# Altium schematic sheet AltiumSTM32_Schematic.SchDoc
size A3; SheetNumber: 1; SheetTotal: 1
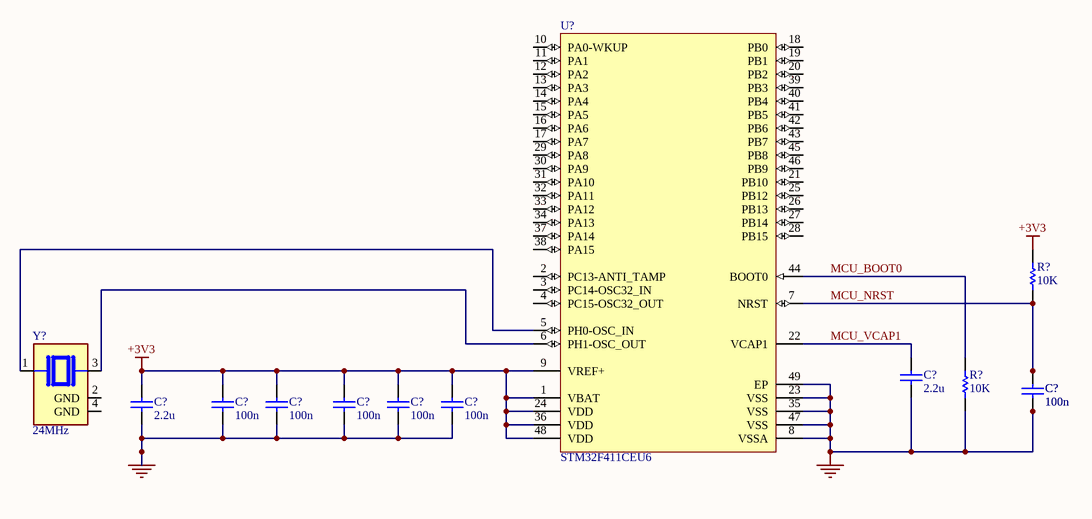
[diagram p0: AltiumSTM32_Schematic.SchDoc]

## Parts
(Parts that share a designator on the sheet are numbered #1, #2 ... from top to bottom, then left to right.)
C?#1  value 2.2u  (hidden comment: Capacitor)
C?#2  value 100n  (hidden comment: Capacitor)
C?#3  value 100n  (hidden comment: Capacitor)
C?#4  value 2.2u  (hidden comment: Capacitor)
C?#5  value 100n  (hidden comment: Capacitor)
C?#6  value 100n  (hidden comment: Capacitor)
C?#7  value 100n  (hidden comment: Capacitor)
C?#8  value 100n  (hidden comment: Capacitor)
C?#9  value 100n  (hidden comment: Capacitor)
R?#1  value 10K  (hidden comment: Resistor)
R?#2  value 10K  (hidden comment: Resistor)
U?  STM32F411CEU6  [STM-UFQFPN48_L]
Y?  24MHz  [XTAL_TSX-3225_24.0000MF15V-C0]

## Nets
+3V3: C?#4.2 C?#5.2 C?#6.2 C?#7.2 C?#8.2 C?#9.2 R?#1.2 U?.1(VBAT) U?.9(VREF+) U?.24(VDD) U?.36(VDD) U?.48(VDD)
GND: C?#1.1 C?#2.1 C?#3.1 C?#4.1 C?#5.1 C?#6.1 C?#7.1 C?#8.1 C?#9.1 R?#2.1 U?.8(VSSA) U?.23(VSS) U?.35(VSS) U?.47(VSS) U?.49(EP)
MCU_BOOT0: R?#2.2 U?.44(BOOT0)
MCU_NRST: C?#2.2 C?#3.2 R?#1.1 U?.7(NRST)
MCU_VCAP1: C?#1.2 U?.22(VCAP1)
NetU?_5: U?.5(PH0-OSC_IN) Y?.1
NetU?_6: U?.6(PH1-OSC_OUT) Y?.3

Not connected (* = marked no-connect by the designer): U? 2(PC13-ANTI_TAMP) 3(PC14-OSC32_IN) 4(PC15-OSC32_OUT) 10(PA0-WKUP) 11(PA1) 12(PA2) 13(PA3) 14(PA4) 15(PA5) 16(PA6) 17(PA7) 18(PB0) 19(PB1) 20(PB2) 21(PB10) 25(PB12) 26(PB13) 27(PB14) 28(PB15) 29(PA8) 30(PA9) 31(PA10) 32(PA11) 33(PA12) 34(PA13) 37(PA14) 38(PA15) 39(PB3) 40(PB4) 41(PB5) 42(PB6) 43(PB7) 45(PB8) 46(PB9); Y? 2(GND) 4(GND)

## Library data of the parts
C?#1-C?#9 = Capacitor: SimulationGenericComponent: True
R?#1 R?#2 = Resistor: TC1: 0; SimulationGenericComponent: True; TC2: 0
U? = CMP-0243-00165-1: ARM Cortex-M4 32-bit MCU+FPU, 512 KB Flash, 128 KB RAM, 36 I/Os, 48-Pin UFQFPN, -40 to 85 degC, Tray; Operating Frequency(F) (Processor speed) (MHz): 100; FLASH Size (Prog) (kB): 512; Internal RAM Size (kB): 128; I/Os (High Current): 36; Supply Voltage(Vcc) min (V): 1.7; Package Reference: 48-Pin Ultra Thin Fine Pitch Quad Flat No-Lead, 7 x 7 x 0.6 mm Body, 0.5 mm Pitch, Exposed Pad; ComponentLink1Description: Manufacturer URL; ComponentLink1URL: http://www.st.com/; Packing: Tray; Package Description: UFQFPN48; Core: ARM Cortex-M4; ComponentLink2Description: Datasheet; ComponentLink2URL: http://www.st.com/st-web-ui/static/active/en/resource/technical/document/datasheet/DM00115249.pdf; DatasheetVersion: Rev. 6; Mounting Technology: Surface Mount
Y? = TSX-3225_24.0000MF15V-C0: 24 MHz Â±10ppm Crystal 18pF 40 Ohms 4-SMD, No Lead; MF: EPSON; MP: TSX-3225 24.0000MF15V-C0; Check_prices: https://www.snapeda.com/parts/TSX-3225%2024.0000MF15V-C0/EPSON/view-part/?ref=eda; SnapEDA_Link: https://www.snapeda.com/parts/TSX-3225%2024.0000MF15V-C0/EPSON/view-part/?ref=snap; Digi-Key_Part_Number: SER4209TR-ND; Value: *; Purchase-URL: https://pricing.snapeda.com/search/part/TSX-3225 24.0000MF15V-C0/?ref=eda; Package: NON STANDARD-4 EPSON